# Altium schematic sheet VSENSE_EQ.SchDoc: BMS - AFE
size A4; DrawnBy: Jarod Krane; SheetNumber: 4; SheetTotal: 8
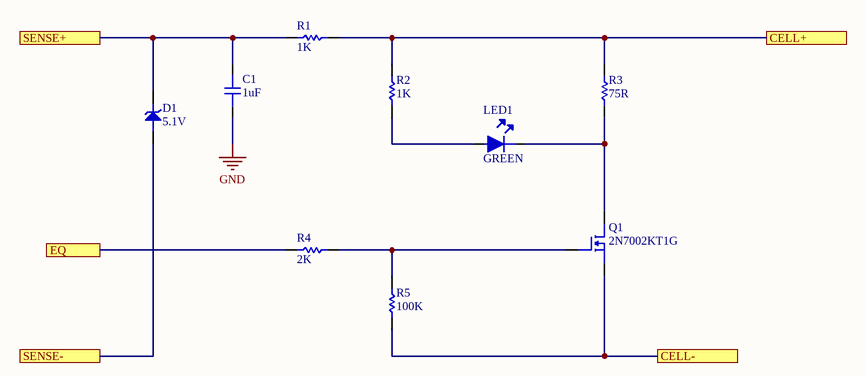
[diagram p0: VSENSE_EQ.SchDoc]

## Parts
C1  1uF  [0805 CAP]
D1  5.1V  [ZENER DIODE]
LED1  GREEN  [LED2]
Q1  2N7002KT1G  [N-MOSFET]
R1  1K  [0603 RES]
R2  1K  [0603 RES]
R3  75R  [2512 RES]
R4  2K  [0603 RES]
R5  100K  [0603 RES]

## Ports
CELL+, CELL-, EQ, SENSE+, SENSE-

## Nets
GND: C1.1
CELL+: R1.2 R2.2 R3.1 ; port CELL+
CELL-: Q1.2 R5.1 ; port CELL-
EQ: R4.1 ; port EQ
SENSE+: C1.2 D1.2 R1.1 ; port SENSE+
SENSE-: D1.1 ; port SENSE-
NetLED1_1: LED1.1 R2.1
NetLED1_2: LED1.2 Q1.3 R3.2
NetQ1_1: Q1.1 R4.2 R5.2

## Library data of the parts
C1 = C2012X7S2A105K125AE: CAP CER 1UF 100V X7S 0805; Manufacturer: TDK; Tolerance: 10%; Supplier 1: Digi-Key; Manufacturer Part Number: C2012X7S2A105K125AE; Stock 1: 20000; Pricing 1: 1=0.5, 10=0.356, 100=0.2347, 500=0.1739, 1000=0.1478 (USD); Mount: Surface Mount; Case/Package: 0805; Case Code (Metric): 2012; Case Code (Imperial): 0805; Min Operating Temperature: -55°C; Max Operating Temperature: 125°C; Capacitance: 1uF; Voltage Rating: 100V; Packaging: Tape and Reel; Termination: SMD/SMT; Package Quantity: 1; Voltage Rating (DC): 100V; Dielectric: X7S; Composition: Ceramic; Features: Soft Termination; Length: 2mm; Height: 1.25mm; Width: 0.05inch; Thickness: 0.049inch; Depth: 1.25mm; Lead Free: Lead Free; ComponentLink1URL: https://product.tdk.com/info/en/catalog/spec/mlccspec_commercial_soft_en.pdf; ComponentLink1Description: https://product.tdk.com/info/en/catalog/spec/mlccspec_commercial_soft_en.pdf; ComponentLink2URL: http://www.mouser.com/ds/2/400/lcc_commercial_soft_en-520032.pdf; ComponentLink2Description: http://www.mouser.com/ds/2/400/lcc_commercial_soft_en-520032.pdf; Supplier Part Number 1: 445-8887-1-ND
D1 = MMSZ4689-TP: DIODE ZENER 5.1V 500MW SOD123; Manufacturer: MCC; Tolerance: 5%; Max Reverse Leakage Current: 10uA; Test Current: 50uA; Element Configuration: Single; Supplier 1: Digi-Key; Manufacturer Part Number: MMSZ4689-TP; Stock 1: 294852; Pricing 1: 1=0.22, 10=0.203, 25=0.146, 100=0.1136, 250=0.0714, 500=0.0608, 1000=0.0414 (USD); Mount: Surface Mount; Number of Pins: 2; Min Operating Temperature: -55°C; Max Operating Temperature: 150°C; Package Quantity: 3000; Packaging: Tape and Reel; Zener Voltage: 5.1V; Max Power Dissipation: 500mW; Voltage Tolerance: 5%; Power Dissipation: 500mW; Zener Current: 50uA; Lead Free: Lead Free; Supplier Part Number 1: MMSZ4689-TPMSCT-ND
LED1 = 150060VS75000: LED GREEN CLEAR 0603 SMD; Manufacturer: Wurth Electronics; Luminous Intensity: 40mcd; Viewing Angle: 140°; Forward Voltage: 2V; Wavelength: 570nm; Lens Style: Clear,Rectangular; Forward Current: 30mA; Test Current: 20mA; Supplier 1: Digi-Key; Manufacturer Part Number: 150060VS75000; Stock 1: 219425; Pricing 1: 1=0.14, 50=0.129, 100=0.11, 500=0.095 (USD); Mount: Surface Mount; Case/Package: 0603; Number of Pins: 2; Colour: Green; Case Code (Metric): 1608; Case Code (Imperial): 0603; Min Operating Temperature: -40°C; Max Operating Temperature: 85°C; Package Quantity: 1; Packaging: Tape and Reel; Dominant Wavelength: 570nm; Length: 1.6mm; Height: 0.7mm; Width: 0.8mm; REACH SVHC: Unknown; ComponentLink1URL: http://www.farnell.com/datasheets/1911347.pdf; ComponentLink1Description: http://www.farnell.com/datasheets/1911347.pdf; ComponentLink2URL: https://katalog.we-online.de/led/datasheet/150060VS75000.pdf; ComponentLink2Description: https://katalog.we-online.de/led/datasheet/150060VS75000.pdf; ComponentLink3URL: https://www.distrelec.biz/Web/Downloads/_t/ds/150060VS75000_eng_tds.pdf?mime=application%2Fpdf; ComponentLink3Description: https://www.distrelec.biz/Web/Downloads/_t/ds/150060VS75000_eng_tds.pdf?mime=application%2Fpdf; ComponentLink4URL: http://www.produktinfo.conrad.com/datenblaetter/750000-774999/759431-da-01-en-CHIPLED_0603_W_KL_H_GRUEN_150060VS7500.pdf; ComponentLink4Description: http://www.produktinfo.conrad.com/datenblaetter/750000-774999/759431-da-01-en-CHIPLED_0603_W_KL_H_GRUEN_150060VS7500.pdf; Supplier Part Number 1: 732-4980-1-ND
Q1 = 2N7002KT1G: MOSFET N-CH 60V 320MA SOT-23; Manufacturer: ON Semiconductor; Input Capacitance: 24.5pF; Max Power Dissipation: 420mW; Rds On Max: 1.6R; Nominal Vgs: 2.3V; Number of Elements: 1; Power Dissipation: 300mW; Turn-Off Delay Time: 55.8ns; Turn-On Delay Time: 12.2ns; Element Configuration: Single; Gate to Source Voltage (Vgs): 20V; Rise Time: 9ns; Supplier 1: Digi-Key; Manufacturer Part Number: 2N7002KT1G; Stock 1: 39226; Pricing 1: 1=0.21, 10=0.193, 100=0.1264, 500=0.0618, 1000=0.0421 (USD); Case/Package: SOT-23-3; Number of Pins: 3; Contact Plating: Matte,Tin; Min Operating Temperature: -55°C; Max Operating Temperature: 150°C; Packaging: Tape and Reel; Continuous Drain Current (ID): 320mA; Package Quantity: 1; Drain to Source Breakdown Voltage: 60V; Drain to Source Resistance: 1.6R; Threshold Voltage: 2.3V; On-State Resistance: 1.6R; Fall Time: 9ns; Length: 3.04mm; Height: 1.01mm; Width: 1.4mm; Radiation Hardening: No; REACH SVHC: No SVHC; Lead Free: Lead Free; Halogen Free: Halogen Free; ComponentLink1URL: http://www.mouser.com/ds/2/308/2N7002K-D-40616.pdf; ComponentLink1Description: http://www.mouser.com/ds/2/308/2N7002K-D-40616.pdf; ComponentLink2URL: http://www.farnell.com/datasheets/2354033.pdf; ComponentLink2Description: http://www.farnell.com/datasheets/2354033.pdf; ComponentLink3URL: http://www.onsemi.ru.com/pub/Collateral/2N7002K-D.PDF; ComponentLink3Description: http://www.onsemi.ru.com/pub/Collateral/2N7002K-D.PDF; ComponentLink4URL: https://www.verical.com/server-webapp/html/getDatasheet?partID=309924; ComponentLink4Description: https://www.verical.com/server-webapp/html/getDatasheet?partID=309924; ComponentLink5URL: http://www.onsemi.com/pub_link/Collateral/2N7002K-D.PDF; ComponentLink5Description: http://www.onsemi.com/pub_link/Collateral/2N7002K-D.PDF; ComponentLink6URL: http://uk.rs-online.com/webdocs/13e9/0900766b813e9f06.pdf; ComponentLink6Description: http://uk.rs-online.com/webdocs/13e9/0900766b813e9f06.pdf; ComponentLink7URL: http://www.onsemi.com/pub/Collateral/2N7002K-D.PDF; ComponentLink7Description: http://www.onsemi.com/pub/Collateral/2N7002K-D.PDF; Supplier Part Number 1: 2N7002KT1GOSCT-ND
R1 R2 = CRCW06031K00FKEA: RES SMD 1K OHM 1% 1/10W 0603; Manufacturer: Vishay Dale; Resistance: 1kR; Power Rating: 100mW; Voltage Rating: 75V; Temperature Coefficient: 100ppm/°C; Supplier 1: Digi-Key; Manufacturer Part Number: CRCW06031K00FKEA; Stock 1: 3823619; Pricing 1: 1=0.1, 10=0.042, 100=0.017, 1000=0.0076, 2500=0.0066 (USD); Mount: Surface Mount; Case/Package: 0603; Number of Pins: 2; Weight: 7.1E-05oz; Case Code (Metric): 1608; Case Code (Imperial): 0603; Contact Plating: Tin; Min Operating Temperature: -55°C; Max Operating Temperature: 155°C; Composition: Thick Film; Tolerance: 1%; Packaging: Tape and Reel; Package Quantity: 10; Number of Terminations: 2; Termination: SMD/SMT; Military Standard: Not; Max Power Dissipation: 100mW; Voltage Rating (DC): 75V; Features: Automotive AEC-Q200; Length: 1.55mm; Height: 0.45mm; Width: 0.033inch; Depth: 0.85mm; Radiation Hardening: No; REACH SVHC: Unknown; Lead Free: Lead Free; Supplier Part Number 1: 541-1.00KHCT-ND
R3 = RMCF2512FT75R0: RES 75 OHM 1% 1W 2512; Manufacturer: Stackpole Electronics; Temperature Coefficient: 100ppm/°C; Supplier 1: Digi-Key; Manufacturer Part Number: RMCF2512FT75R0; Stock 1: 8250; Pricing 1: 1=0.39, 10=0.333, 100=0.1301, 1000=0.0545 (USD); Mount: Surface Mount; Case/Package: 2512; Contact Plating: Matte,Tin; Min Operating Temperature: -55°C; Max Operating Temperature: 155°C; Packaging: Tape and Reel; Resistance: 75R; Tolerance: 1%; Power Rating: 1W; Composition: Thick Film; Package Quantity: 4000; Number of Terminations: 2; Max Power Dissipation: 1W; Features: Automotive AEC-Q200; Length: 0.248inch; Height: 0.028inch; Width: 0.126inch; Radiation Hardening: No; Supplier Part Number 1: RMCF2512FT75R0CT-ND
R4 = CRCW06032K00FKEA: RES SMD 2K OHM 1% 1/10W 0603; Manufacturer: Vishay; Power Rating: 100mW; Resistance: 2kR; Voltage Rating: 75V; Temperature Coefficient: 100ppm/°C; Supplier 1: Digi-Key; Manufacturer Part Number: CRCW06032K00FKEA; Stock 1: 388348; Pricing 1: 1=0.1, 10=0.042, 100=0.017, 1000=0.0076, 2500=0.0066 (USD); Mount: Surface Mount; Case/Package: 0603; Number of Pins: 2; Weight: 7.1E-05oz; Case Code (Imperial): 0603; Case Code (Metric): 1608; Contact Plating: Lead,Tin; Min Operating Temperature: -55°C; Max Operating Temperature: 155°C; Tolerance: 1%; Packaging: Tape and Reel; Composition: Thick Film; Package Quantity: 10; Military Standard: Not; Termination: Solder; Voltage Rating (DC): 75V; Number of Terminations: 2; Max Power Dissipation: 100mW; Features: Automotive AEC-Q200; Length: 1.55mm; Height: 0.45mm; Width: 0.85mm; Depth: 0.85mm; Radiation Hardening: No; REACH SVHC: Unknown; Lead Free: Lead Free; Supplier Part Number 1: 541-2.00KHCT-ND
R5 = ERJ-3EKF1003V: RES SMD 100K OHM 1% 1/10W 0603; Manufacturer: Panasonic; Manufacturer Part Number: ERJ3EKF-1003V; Resistance: 100kR; Power Rating: 100mW; Voltage Rating: 75V; Temperature Coefficient: 100ppm/°C; Supplier 1: Digi-Key; Stock 1: 10349154; Pricing 1: 1=0.1, 10=0.064, 100=0.0261, 1000=0.0117, 2500=0.0102 (USD); Case/Package: 0603; Number of Pins: 2; Case Code (Metric): 1608; Case Code (Imperial): 0603; Contact Plating: Tin; Min Operating Temperature: -55°C; Max Operating Temperature: 155°C; Tolerance: 1%; Packaging: Tape and Reel; Composition: Thick Film; Military Standard: Not; Voltage Rating (DC): 75V; Length: 1.6mm; Depth: 0.8mm; Width: 800um; Radiation Hardening: No; REACH SVHC: No SVHC; Lead Free: Lead Free; Supplier Part Number 1: P100KHCT-ND